# EAGLE design MCP3221 (EAGLE 7.2.0)
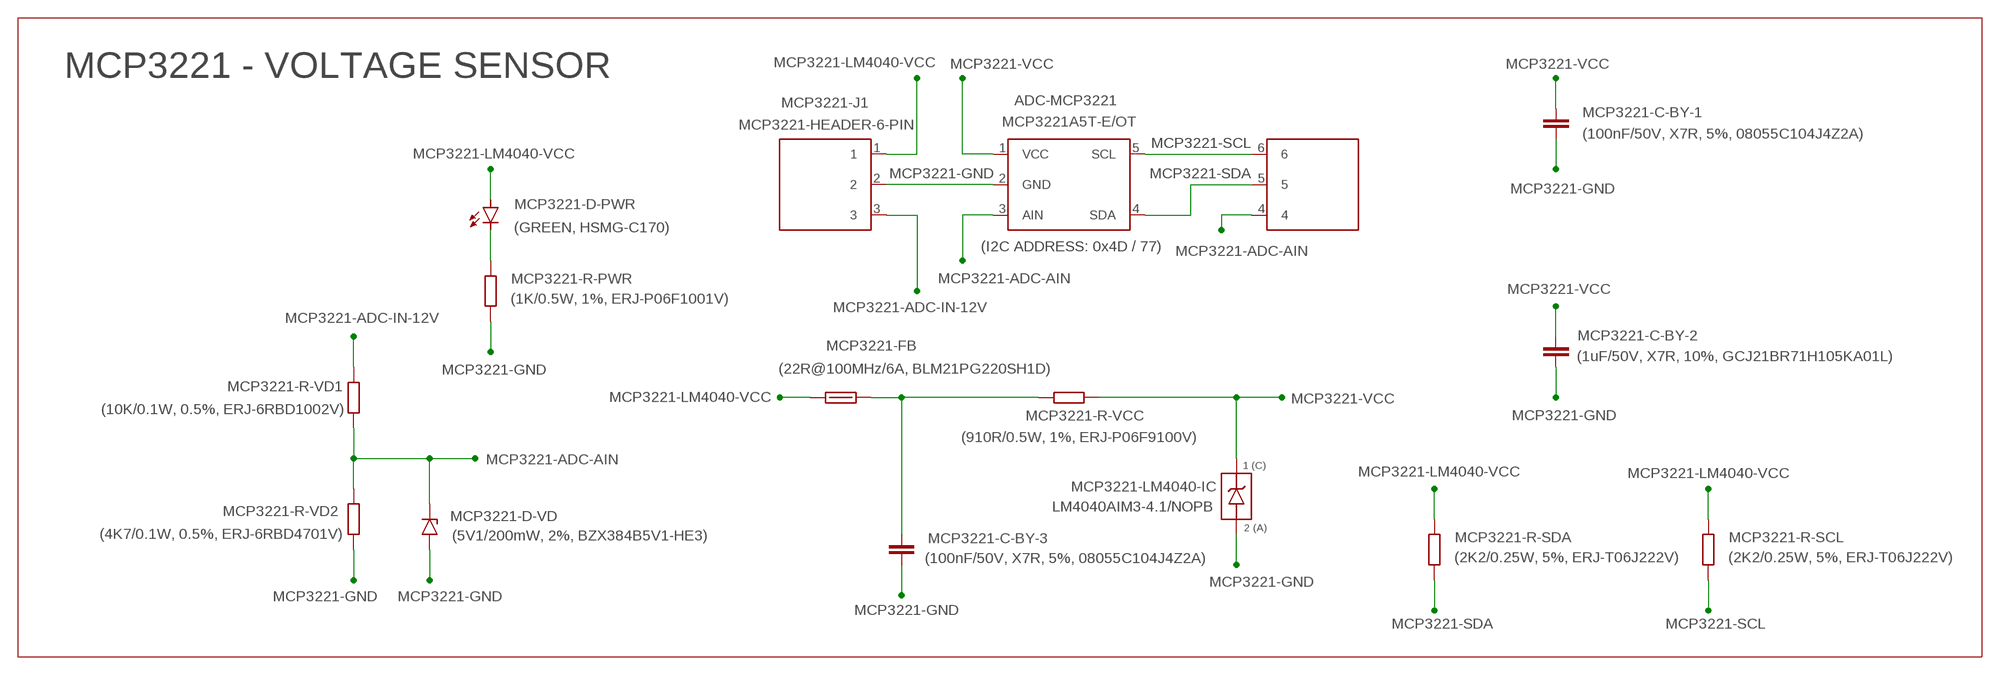
[diagram p0: schematic, sheet 1]

## Parts
ADC-MCP3221  MCP3221A5T-E/OT  [SOT-23-5]
MCP3221-C-BY-1  (100nF/50V, X7R, 5%, 08055C104J4Z2A)  08055C104J4Z2A  [0805]
MCP3221-C-BY-2  (1uF/50V, X7R, 10%, GCJ21BR71H105KA01L)  GCJ21BR71H105KA01L  [0805]
MCP3221-C-BY-3  (100nF/50V, X7R, 5%, 08055C104J4Z2A)  08055C104J4Z2A  [0805]
MCP3221-D-PWR  (GREEN, HSMG-C170)  HSMG-C170  [DIODE_0805]
MCP3221-D-VD  (5V1/200mW, 2%, BZX384B5V1-HE3)  BZX384B5V1-HE3  [SOD-323-DIODE]
MCP3221-FB  (22R@100MHz/6A, BLM21PG220SH1D)  BLM21PG220SH1D  [0805]
MCP3221-J1  MCP3221-HEADER-6-PIN  HEADER_6_PIN  [HEADER_2.54MM_6_PIN_VER]
MCP3221-LM4040-IC  LM4040AIM3-4.1/NOPB  [SOT-23-3]
MCP3221-R-PWR  (1K/0.5W, 1%, ERJ-P06F1001V)  ERJ-P06F1001V  [0805]
MCP3221-R-SCL  (2K2/0.25W, 5%, ERJ-T06J222V)  ERJ-T06J222V  [0805]
MCP3221-R-SDA  (2K2/0.25W, 5%, ERJ-T06J222V)  ERJ-T06J222V  [0805]
MCP3221-R-VCC  (910R/0.5W, 1%, ERJ-P06F9100V)  ERJ-P06F9100V  [0805]
MCP3221-R-VD1  (10K/0.1W, 0.5%, ERJ-6RBD1002V)  ERJ-6RBD1002V  [0805]
MCP3221-R-VD2  (4K7/0.1W, 0.5%, ERJ-6RBD4701V)  ERJ-6RBD4701V  [0805]

## Nets
MCP3221-ADC-AIN: ADC-MCP3221.3(AIN) MCP3221-D-VD.C MCP3221-J1.4 MCP3221-R-VD1.2 MCP3221-R-VD2.1
MCP3221-ADC-IN-12V: MCP3221-J1.3 MCP3221-R-VD1.1
MCP3221-GND: ADC-MCP3221.2(GND) MCP3221-C-BY-1.2(C) MCP3221-C-BY-2.1(A) MCP3221-C-BY-3.2(C) MCP3221-D-VD.A MCP3221-J1.2 MCP3221-LM4040-IC.2(A) MCP3221-LM4040-IC.3(A) MCP3221-R-PWR.1 MCP3221-R-VD2.2
MCP3221-LM4040-VCC: MCP3221-D-PWR.A MCP3221-FB.2 MCP3221-J1.1 MCP3221-R-SCL.2 MCP3221-R-SDA.2
MCP3221-LM4040_VCC_FILTERED: MCP3221-C-BY-3.1(A) MCP3221-FB.1 MCP3221-R-VCC.2
MCP3221-PWR: MCP3221-D-PWR.C MCP3221-R-PWR.2
MCP3221-SCL: ADC-MCP3221.5(SCL) MCP3221-J1.6 MCP3221-R-SCL.1
MCP3221-SDA: ADC-MCP3221.4(SDA) MCP3221-J1.5 MCP3221-R-SDA.1
MCP3221-VCC: ADC-MCP3221.1(VCC) MCP3221-C-BY-1.1(A) MCP3221-C-BY-2.2(C) MCP3221-LM4040-IC.1(C) MCP3221-R-VCC.1

## Notes on the sheet
- MCP3221 - VOLTAGE SENSOR
- (I2C ADDRESS: 0x4D / 77)

## Library data of the parts
ADC-MCP3221 = TDAR4:MCP3221: MICROCHIP SMD IC ADC, 1-CHANNEL, 12-BIT, I2C http://ww1.microchip.com/downloads/en/DeviceDoc/21732D.pdf 2C ADDRESSES: Part No. Package I2C Address Marking BIN HEX DEC MCP3221A0T-E/OT GE 1001000+R/W 0x48 72 MCP3221A1T-E/OT GE 1001001+R/W 0x49 73 MCP3221A2T-E/OT GE 1001010+R/W 0x4A 74 MCP3221A3T-E/OT GE 1001011+R/W 0x4B 75 MCP3221A4T-E/OT GE 1001100+R/W 0x4C 76 MCP3221A5T-E/OT GE 1001101+R/W 0x4D 77 MCP3221A6T-E/OT GE 1001110+R/W 0x4E 78 MCP3221A7T-E/OT GE 1001111+R/W 0x4F 79 MOUSER: 579-MCP3221A0T-E/OT (MCP3221A0T-E/OT) - 0x48 (72) 579-MCP3221A4T-E/OT (MCP3221A4T-E/OT) - 0x4C (76) 579-MCP3221A5T-E/OT (MCP3221A5T-E/OT) - 0x4D (77) 579-MCP3221A6T-E/OT (MCP3221A6T-E/OT) - 0x4E (78)
MCP3221-C-BY-1 MCP3221-C-BY-3 = TDAR4:08055C104J4Z2A: AVX SMD MLCC 0.1uF/50V, X7R, 5%, Flexible, Automotive
MCP3221-C-BY-2 = TDAR4:GCJ21BR71H105KA01L: MURATA SMD MLCC 1uF/50V, X7R, 10%, Flexible, Automotive
MCP3221-D-PWR = TDAR4:HSMG-C170: BROADCOM SMD DIODE LED (GREEN), 15mcd, 20mA, 2.2Vf, 170°, Diffused, Standard
MCP3221-D-VD = TDAR4:BZX384: VISHAY DIODE ZENER 5V1/5V6, 200mW, 2%, AEC-Q101, Automotive http://www.vishay.com/docs/85764/bzx384.pdf 5V1 MOUSER: BZX384B5V1-HE3-08 / BZX384B5V1-HE3-18 (78-BZX384B5V1-HE3-08 / 78-BZX384B5V1-HE3-18) 5V6 MOUSER: BZX384B5V6-HE3-08 / BZX384B5V6-HE3-18 (78-BZX384B5V6-HE3-08 / 78-BZX384B5V6-HE3-18)
MCP3221-FB = TDAR4:BLM21PG220SH1D: MURATA FERRITE BEAD 22R @ 100MHz, 6A, EMI Filter Powerlines, AEC-Q200, Automotive
MCP3221-J1 = TDAR4:HEADER_6_PIN
MCP3221-LM4040-IC = TDAR4:LM4040: TI SMD IC VOLTAGE REFERENCE SHUNT 2.048V/4.096V, 15mA, 0.1%, AEC-Q100, Automotive LM4040AIM3-2.0/NOPB 2.048V LM4040AIM3-4.1/NOPB 4.096V
MCP3221-R-PWR = TDAR4:ERJ-P06F1001V: PANASONIC SMD RESISTOR THICK FILM 1K/0.5W, 1%, 100ppm, AEC-Q200, Automotive
MCP3221-R-SCL MCP3221-R-SDA = TDAR4:ERJ-T06J222V: PANASONIC SMD RESISTOR THICK FILM 2K2/0.25W, 5%, 200ppm, AEC-Q200, Automotive
MCP3221-R-VCC = TDAR4:ERJ-P06F9100V: PANASONIC SMD RESISTOR THICK FILM 910R/0.5W, 1%, 100ppm, AEC-Q200, Automotive
MCP3221-R-VD1 = TDAR4:ERJ-6RBD1002V: PANASONIC SMD RESISTOR 10K/100mW, 0.5%, 50ppm, AEC-Q200, Automotive
MCP3221-R-VD2 = TDAR4:ERJ-6RBD4701V: PANASONIC SMD RESISTOR 4K7/100mW, 0.5%, 50ppm, AEC-Q200, Automotive

## Net classes
0 default: clearance 0.355 mm

## Board
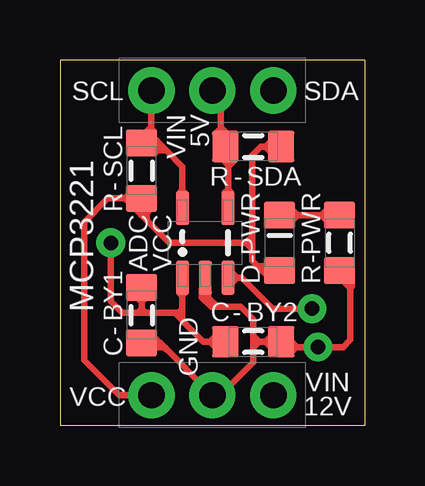
[diagram p1: board, top side]
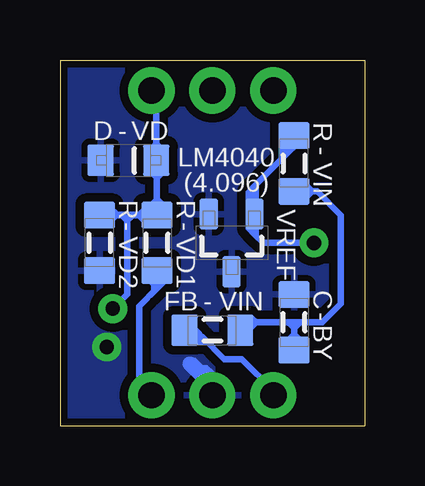
[diagram p2: board, bottom side, seen from below]

Size 12.7 x 15.24 mm. Coordinates in mm from the lower left corner, seen from the top.
Outline: 12.7,15.24 0,15.24 0,0 12.7,0 12.7,15.24
Copper layers (1*16): Top 0.035mm / dielectric 1.5mm / Bottom 0.035mm
Design rules "ITEADstudio_DRC *": minimum track width 10mil, minimum drill 12mil, track to track 10mil, track to pad 10mil, pad to pad 10mil, via to via 10mil, smd to smd 0mil, copper to edge 12mil, drill to drill 12mil, minimum pad ring 10mil, minimum via ring 6mil, stop-mask expansion 2mil, vias tented up to drill 100mil, thermal gap 10mil

### Footprints (pad centres in the part's own frame; a part is rotated, then mirrored left to right if it is on the bottom)
SOT-23-5 = smd 1.4 x 0.55: 1 -1.45,0.95; 2 -1.45,0; 3 -1.45,-0.95; 4 1.45,-0.95; 5 1.45,0.95
0805 = smd 1.1 x 1.3: 1 -1.16,0; 2 1.16,0
DIODE_0805 = smd 1.1 x 1.3: A 1.16,0; C -1.16,0
SOD-323-DIODE = smd 1.1 x 1.3: A 1.16,0; C -1.16,0
HEADER_2.54MM_6_PIN_VER = drill 1.1 pad 1.925: 1 -6.35,2.54; 2 -6.35,0; 3 -6.35,-2.54; 4 6.35,-2.54; 5 6.35,0; 6 6.35,2.54
SOT-23-3 = smd 0.75 x 1.3: 1 -0.95,-1.2; 2 0.95,-1.2; 3 0,1.2

### Placement (x,y rotation side)
ADC-MCP3221  6.05,7.62 90 top
MCP3221-C-BY-1  3.4,4.61 270 top
MCP3221-C-BY-2  8.05,3.5 180 top
MCP3221-C-BY-3  2.95,4.31 90 bottom
MCP3221-D-PWR  9.15,7.62 270 top
MCP3221-D-VD  9.85,11.06 180 bottom
MCP3221-FB  6.35,3.98 180 bottom
MCP3221-J1  6.35,7.62 90 top
MCP3221-LM4040-IC  5.55,7.62 180 bottom
MCP3221-R-PWR  11.65,7.62 90 top
MCP3221-R-SCL  3.4,10.63 270 top
MCP3221-R-SDA  8.05,11.63 0 top
MCP3221-R-VCC  2.95,10.93 270 bottom
MCP3221-R-VD1  8.66,7.62 90 bottom
MCP3221-R-VD2  11.05,7.62 270 bottom

### Tracks (layer width: path | path; a pad name or v marks a point on that pad's centre or on a via)
MCP3221-ADC-AIN  (via drill 0.6 pad 1.2)
  Top 0.279: v10.5,4.88 8.86,4.88 7.57,6.17 ADC-MCP3221.3 7.38,6.17 | 7.38,6.17 7.13,6.42 7.13,5.92 7.38,6.17
  Bottom 0.279: 9.9,8.78 MCP3221-R-VD2.1 10.39,8.78 | 9.9,8.78 9.28,8.78 | 9.28,8.78 MCP3221-R-VD1.2 | v10.5,4.88 9.9,5.48 9.9,8.78 | MCP3221-R-VD1.2 8.69,8.78 | 8.66,11 8.66,11.26 8.65,11.26 | 8.66,11 MCP3221-R-VD1.2 | 9.17,9.03 9.42,8.78 | 9.42,8.78 9.17,8.53 9.17,9.03 | 8.91,9.19 8.66,9.44 8.41,9.19 8.91,9.19 | 8.91,9.19 8.66,8.94 MCP3221-R-VD1.2 | 9.17,9.03 8.93,8.78 MCP3221-R-VD1.2 | 10.39,8.78 10.64,8.53 10.64,9.03 10.39,8.78 | 9.66,8.78 9.91,8.53 10.16,8.78 9.66,8.78 | 9.42,8.78 9.43,8.78 9.66,8.78 | 8.66,11 8.69,11.03 MCP3221-D-VD.C 8.69,11.76 | MCP3221-J1.4 8.69,13.77 8.69,11.76 | 10.81,8.42 10.71,8.42 10.41,8.72 10.41,8.85 10.56,9.01 10.55,9.01 10.33,8.79 9.29,8.79 9.28,8.78 | 8.33,10.64 8.66,10.31 | 8.66,10.31 8.66,10.23 | 8.66,10.31 8.66,10.33 8.88,10.54 8.88,11.57 8.69,11.76 | 8.69,11.76 8.44,11.51 8.44,11.22
MCP3221-ADC-IN-12V
  Bottom 0.279: MCP3221-J1.3 9.4,1.78 9.4,4.98 8.66,5.72 8.66,5.77 | 8.66,5.77 MCP3221-R-VD1.1 | 9.01,6.21 9.01,6.12 8.77,5.88 | 8.77,5.88 8.77,5.61 | 8.77,5.61 8.91,5.47 | 8.77,5.61 8.28,6.1 8.28,6.54 | 8.66,5.77 8.77,5.88
MCP3221-GND  (via drill 0.6 pad 1.2)
  Top 0.279: 6.3,4.96 7.53,4.96 8.05,4.43 8.05,3.5 | 12.1,5.86 12.1,3.58 11.8,3.28 v10.75,3.28 9.21,3.28 MCP3221-C-BY-2.1 | 12.1,5.86 12.1,6.46 MCP3221-R-PWR.1 | 6.3,4.96 6.05,5.21 ADC-MCP3221.2 | MCP3221-C-BY-2.1 8.55,3.5 | 8.55,3.5 8.3,3.5 | 8.3,3.5 8.05,3.5 | 6.07,5.84 5.92,5.68 5.92,5.33 6.3,4.95 | 6.3,4.95 6.57,4.95 6.18,5.33 6.18,5.59 | 6.3,4.96 6.3,4.95 | 8.55,3.5 8.8,3.25 8.8,3.75 8.55,3.5 | 8.3,3.5 8.05,3.26 8.05,3.76 8.3,3.51 8.3,3.5 | 8.55,3.5 | 9.62,3.54 9.87,3.29 9.62,3.04 9.62,3.54 | 11.64,6.2 12.1,5.74 | 12.1,5.74 12.1,5.5 | 12.1,5.74 12.16,5.8 12.1,5.86 | 9.62,3.54 9.59,3.5 MCP3221-C-BY-2.1 | 12.1,5.86 | 12.03,6.37 12.16,6.23 12.16,5.8 12.1,5.86 | 12.1,5.86 11.9,6.07 11.9,6.09 | 4.17,3.45 MCP3221-C-BY-1.2 | 8.05,3.5 8.05,2.65 6.67,1.27 MCP3221-J1.2 4.17,3.45 | 3.91,3.12 3.91,3.15 4.03,3.27 | 4.03,3.27 4.36,3.27 4.45,3.17 3.91,3.71 | 4.04,3.32 4.04,3.58 4.19,3.43 4.04,3.28 | 4.04,3.32 4.04,3.28 | 4.04,3.28 4.04,3.27 4.03,3.27 | 4.17,3.45 4.04,3.32
  Bottom 0.279: v10.75,3.28 10.5,3.28 | 7.1,2.7 6.8,2.4 6.6,2.4 6.4,2.2 6.4,2.1
  Bottom 0.61: 7.3,2.58 6.4,1.68 6.4,1.3
  pour Bottom (isolate 0.279): 0.16,0.16 0.16,15.08 12.54,15.08 12.54,0.16
MCP3221-LM4040-VCC
  Top 0.279: 8,7.62 8,6.88 8.42,6.46 | 8,7.62 8,11.28 8.36,11.63 MCP3221-R-SDA.2 8.55,11.63 | MCP3221-D-PWR.A 8.42,6.46 | MCP3221-J1.1 2.46,1.27 1,2.73 1,8.48 1.99,9.47 MCP3221-R-SCL.2 3.4,8.98 | 8,7.62 4.56,7.62 3.4,8.78 | 8.88,6.12 8.76,6.12 8.24,6.64 8.24,6.65 8.81,6.65 8.84,6.62 8.59,6.62 8.42,6.46 | 8,7.62 8,7.87 7.75,7.62 8,7.37 8,7.62 | 8.55,11.63 8.8,11.88 8.8,11.38 8.55,11.63 | 8,7.62 | 3.4,8.78 3.4,8.98 | 3.4,8.78 3.02,9.16 2.99,9.16 2.99,9.19 2.85,9.33 | 3.85,9.17 3.83,9.17 3.61,8.95 | 3.61,8.95 3.61,8.57 3.63,8.55 | 3.56,8.8 3.56,8.81 3.63,8.88 | 3.63,8.88 3.81,9.06 | 3.47,8.91 3.28,8.91 3.43,8.76 3.58,8.91 | 2.85,9.33 2.85,9.63 2.7,9.48 2.85,9.33 | 3.58,8.91 3.58,8.92 3.61,8.95 | 3.58,8.91 3.47,8.91 | 3.47,8.91 3.4,8.98 | 3.58,8.91 3.59,8.91 3.63,8.88
  Bottom 0.279: MCP3221-FB.2 7.51,3.68 6.75,3.68 5.85,2.78 5.12,2.78 3.81,1.47 MCP3221-J1.1 | 7.4,3.53 7.35,3.49 6.56,3.49 7.18,4.11 7.42,4.11 7.42,4.07 MCP3221-FB.2 | 7.19,3.69 7.19,3.56 | 7.19,3.56 7.1,3.47 | 7.19,3.56 7.51,3.88 MCP3221-FB.2
MCP3221-LM4040_VCC_FILTERED
  Bottom 0.279: 2.95,4.31 4.99,4.31 4.99,3.98 MCP3221-FB.1 | 2.95,4.31 1.77,4.31 1,5.08 1,8.78 1.99,9.77 2.19,9.77 | 2.19,9.77 MCP3221-R-VCC.2 | MCP3221-C-BY-3.1 2.95,3.81 | 2.95,3.81 2.95,4.06 | 2.19,9.77 2.44,9.52 2.44,10.02 2.19,9.77 | 4.92,4.49 4.71,4.49 4.53,4.31 4.81,4.03 4.89,4.03 4.94,3.98 MCP3221-FB.1 | 2.95,4.06 3.2,4.31 2.7,4.31 2.95,4.06 | 2.95,3.81 2.7,3.56 3.2,3.56 2.95,3.81 | 2.95,4.06 2.95,4.31 | 4.91,4.08 4.82,4.08 | 4.82,4.08 4.8,4.06 | 4.82,4.08 4.92,3.98 MCP3221-FB.1
MCP3221-PWR
  Top 0.279: 11.14,9.03 10.89,8.78 11.14,8.53 11.14,9.03 | 9.66,8.53 9.91,8.78 9.66,9.03 9.66,8.53 | 11.14,9.03 11.39,8.78 MCP3221-R-PWR.2 MCP3221-D-PWR.C 9.4,8.78 9.66,8.53
MCP3221-SCL
  Top 0.279: ADC-MCP3221.5 5.1,9.81 | 5.1,9.81 5.1,10.8 4.42,11.48 | 4.42,11.48 4.11,11.79 4.04,11.79 | 4.04,11.79 MCP3221-R-SCL.1 3.81,12.2 3.81,12.28 | MCP3221-J1.6 3.81,12.28 | 3.7,11.99 3.91,11.99 4.14,11.76 | 4.14,11.76 4.25,11.65 | 4.31,11.59 4.25,11.65 | 4.25,11.65 4.12,11.65 3.89,11.42 3.77,11.42 | 3.99,11.74 3.99,11.91 4.14,11.76 | 3.99,11.74 3.99,11.61 4.14,11.76 | 3.81,12.28 3.61,12.28 3.76,12.43 3.91,12.28 3.81,12.28 | 4.04,11.79 3.99,11.74 | 4.14,11.76 | 3.81,12.28 | 5.12,9.3 5.24,9.42 5.24,9.68 5.1,9.81 | 5.1,9.81 4.96,9.68 4.96,9.49 | 3.69,11.38 3.97,11.38 4.07,11.48 4.42,11.48
MCP3221-SDA
  Top 0.279: 7,11.53 MCP3221-R-SDA.1 | MCP3221-J1.5 6.7,13.62 6.7,11.62 MCP3221-R-SDA.1 | 6.97,12.17 6.72,12.42 6.47,12.17 6.97,12.17 | 6.75,11.13 7,10.88 7.25,11.13 6.92,11.13 | 6.92,11.13 6.75,11.13 | 7,11.53 6.92,11.44 6.92,11.13 | MCP3221-R-SDA.1 6.97,11.72 6.97,12.17 | 6.97,9.12 6.97,9.1 ADC-MCP3221.4 7,9.83 | 7.25,11.47 7.3,11.42 7.3,11.08 7.05,10.83 7.04,10.83 6.75,11.12 6.75,11.13 | 7,11.53 7,9.83 | 7.05,9.13 7.14,9.22 7.14,9.7 7,9.83 | 7,9.83 6.87,9.7 6.87,9.45
MCP3221-VCC  (via drill 0.6 pad 1.2)
  Top 0.279: 6.24,3.5 6.49,3.25 6.49,3.75 6.24,3.5 | 6.24,3.5 | 6.24,3.5 MCP3221-C-BY-2.2 5.97,3.5 5.1,4.38 5.1,4.7 | 5.1,4.8 ADC-MCP3221.1 5.04,6.11 5.04,5.99 4.96,5.92 4.96,5.55 5.1,5.42 5.24,5.56 5.24,5.67 | 5.1,4.8 5.1,4.7 | 5.1,4.7 4.97,4.7 | 4.97,4.7 3.4,4.7 | v2.12,7.62 2.12,5.18 2.6,4.7 3.4,4.7 | MCP3221-C-BY-1.1 3.4,4.79 | 3.4,4.79 3.4,4.7 | 3.41,4.87 3.56,4.72 3.26,4.72 3.41,4.87 | 3.39,5.17 3.24,5.32 3.54,5.32 3.39,5.17 | 3.41,4.87 3.41,4.8 3.4,4.79 | 3.41,4.87 3.41,5.15 3.39,5.17 | 5.05,4.84 5.05,4.54 4.9,4.69 5.05,4.84 | 5.05,4.84 5.1,4.8 | 4.78,4.7 5.04,4.7 5.06,4.69 4.99,4.69 4.97,4.7 | 4.6,4.7 4.78,4.7 | 4.78,4.7 5.24,4.24
  Bottom 0.279: v2.12,7.62 4.24,7.62 4.6,7.98 | 4.6,9.98 MCP3221-LM4040-IC.1 4.6,7.98 | 4.6,9.98 3.25,11.33 | 3.25,11.33 3.25,11.43 | 3.25,11.43 3.25,12.09 MCP3221-R-VCC.1 | 3.25,11.43 3,11.68 3.46,11.68 3.46,11.12 | 3.46,11.12 3.52,11.06 | 3.46,11.12 3.09,11.49 3.09,11.91 3.39,11.6 3.39,11.25 | 4.67,8.48 4.84,8.31 4.84,8.22 4.6,7.98 | 4.6,7.98 4.53,7.92 4.53,8.43 4.53,8.44 | 4.75,9.01 4.84,9.1 4.84,9.74 4.54,10.05 4.54,9.97 | 4.54,9.97 4.54,9.29 4.61,9.21 | 4.6,7.98 | 4.6,9.98 4.6,9.97 4.54,9.97 | 2.55,12 2.6,12 2.82,11.77 | 2.82,11.77 3.27,11.33 | 3.25,11.33 2.82,11.76 2.82,11.77

### Text on the board
tNames: SCL | SDA | VIN | 5V | SCL | - | R | - | SDA | R | MCP3221 | ADC | VCC | PWR | PWR | - | - | D | R | BY1 | C | - | BY2 | - | C | GND | VIN | VCC | 12V
bNames: R | VD | - | D | - | LM4040 | VIN | (4.096) | R | R | VREF | - | - | VD1 | VD2 | - | C | VIN | - | FB | BY